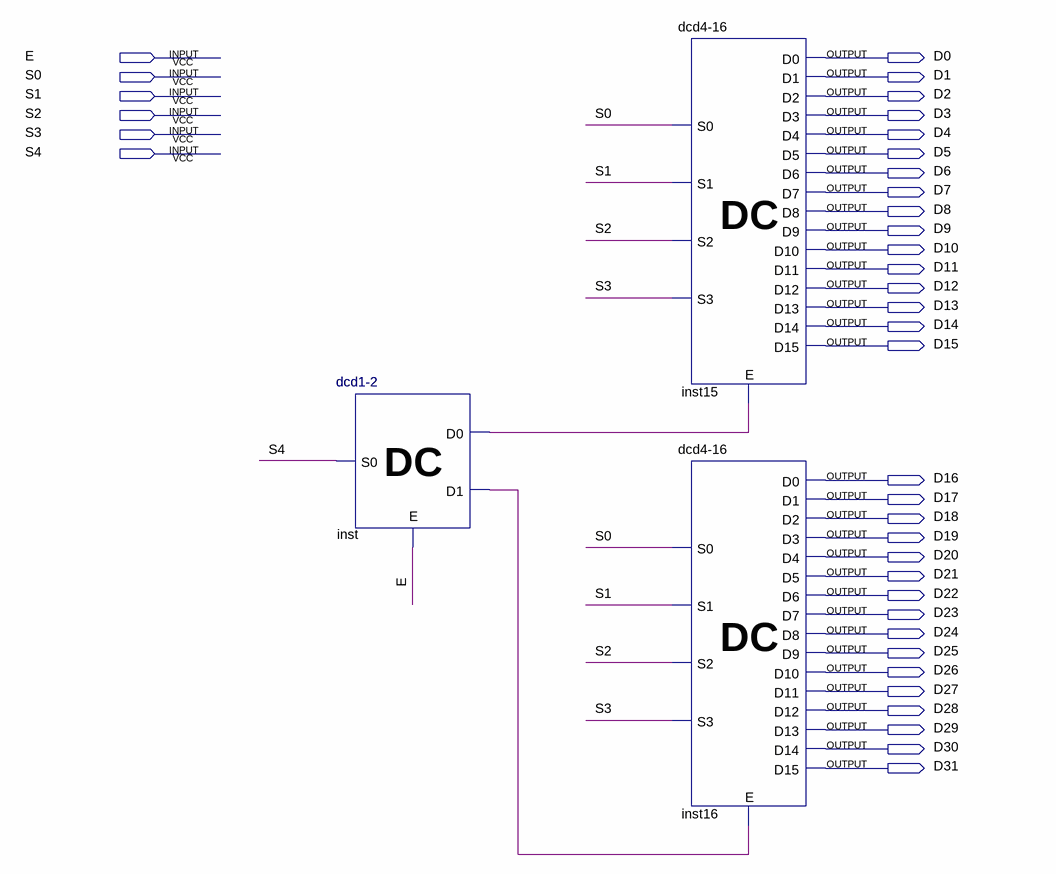
[diagram p0: schematic sheet]
// Quartus schematic dcd5-32.bdf as structural Verilog: 3 symbols, 38 pins
module \dcd5-32  (
  input  E,
  input  S0,
  input  S1,
  input  S2,
  input  S3,
  input  S4,
  output D0,
  output D1,
  output D2,
  output D3,
  output D4,
  output D5,
  output D6,
  output D7,
  output D8,
  output D9,
  output D10,
  output D11,
  output D12,
  output D13,
  output D14,
  output D15,
  output D16,
  output D17,
  output D18,
  output D19,
  output D20,
  output D21,
  output D22,
  output D23,
  output D24,
  output D25,
  output D26,
  output D27,
  output D28,
  output D29,
  output D30,
  output D31
);

  wire inst_d0, inst_d1;

  \dcd1-2  inst (.E(E), .S0(S4), .D0(inst_d0), .D1(inst_d1));
  \dcd4-16  inst15 (
    .S0(S0), .S1(S1), .S2(S2), .S3(S3), .E(inst_d0), .D0(D0), .D1(D1), .D2(D2), .D3(D3), .D4(D4), .D5(D5),
    .D6(D6), .D7(D7), .D8(D8), .D9(D9), .D10(D10), .D11(D11), .D12(D12), .D13(D13), .D14(D14), .D15(D15));
  \dcd4-16  inst16 (
    .S0(S0), .S1(S1), .S2(S2), .S3(S3), .E(inst_d1), .D0(D16), .D1(D17), .D2(D18), .D3(D19), .D4(D20),
    .D5(D21), .D6(D22), .D7(D23), .D8(D24), .D9(D25), .D10(D26), .D11(D27), .D12(D28), .D13(D29), .D14(D30),
    .D15(D31));
endmodule
